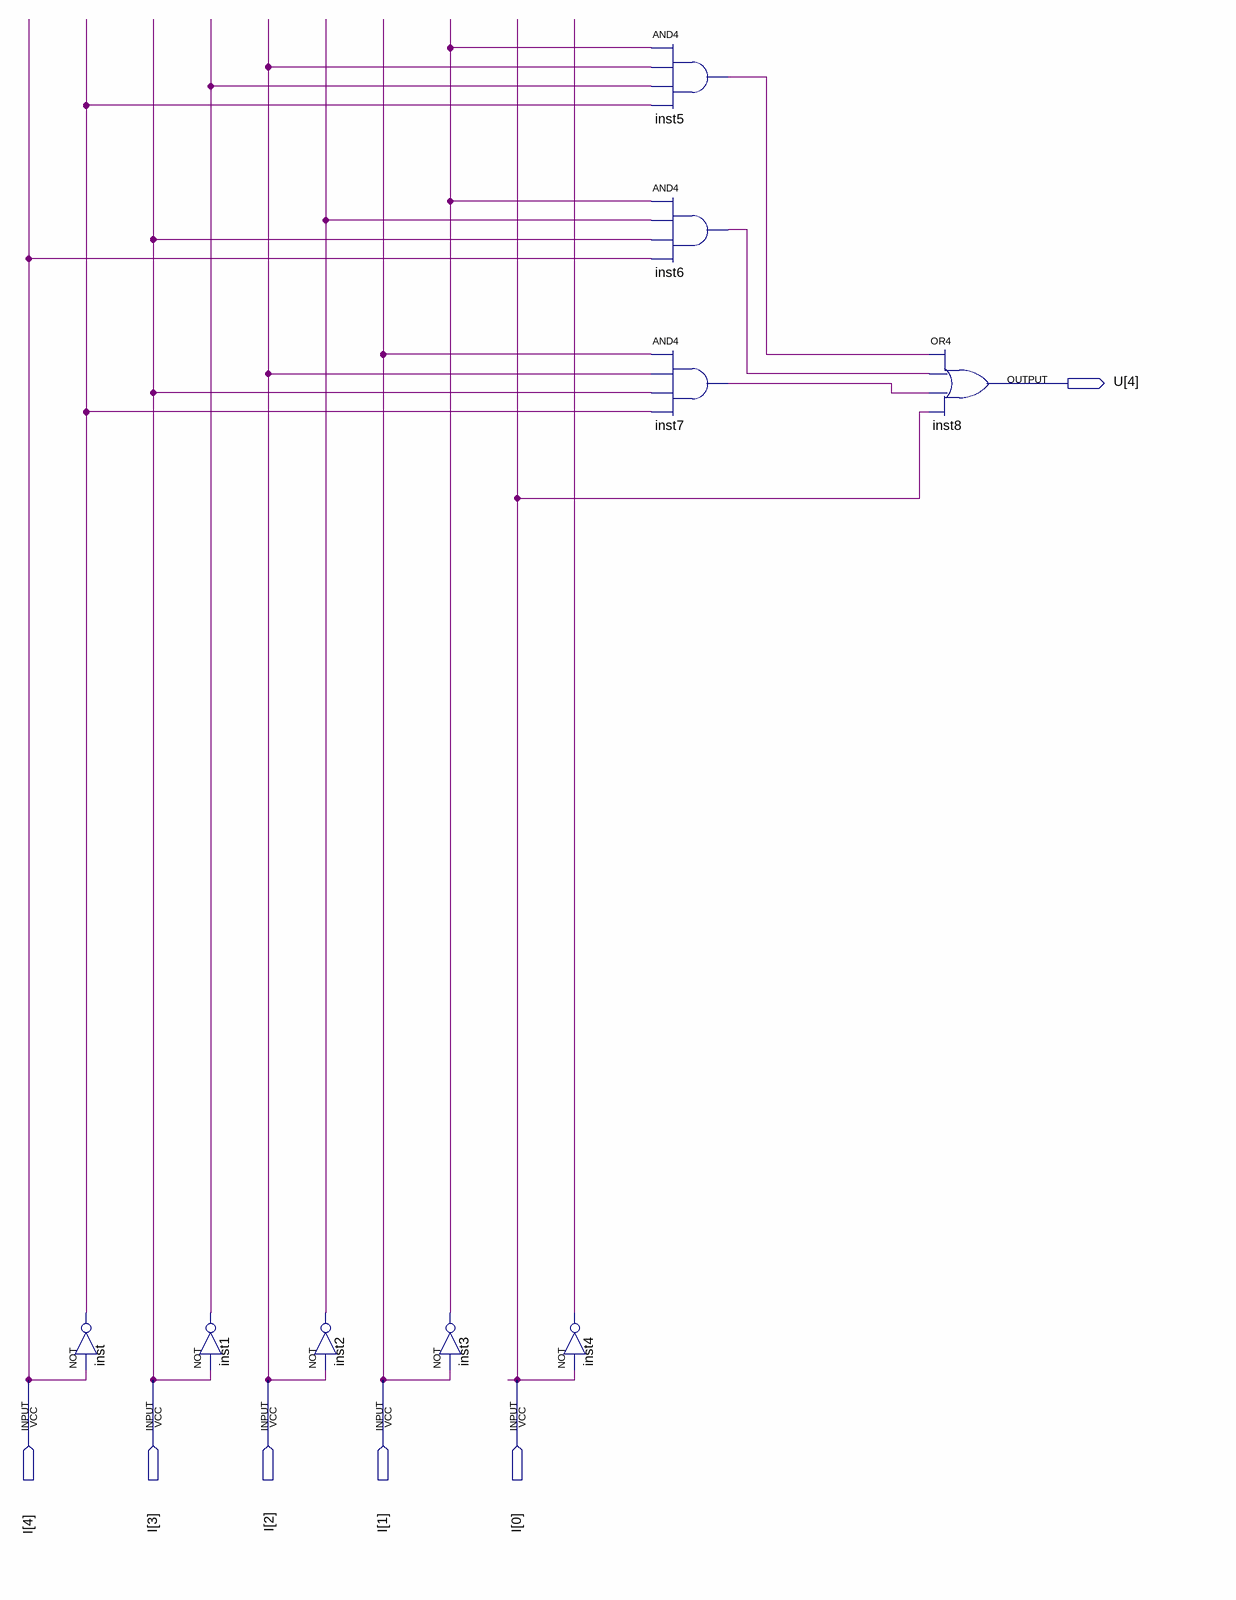
[diagram p0: schematic sheet]
// Quartus schematic BCD_e_Segment2.bdf as structural Verilog: 9 symbols, 6 pins
module BCD_e_Segment2 (
  input  [4:0] I,
  output [4:4] U
);

  wire inst1_out, inst2_out, inst3_out, inst4_out, inst5_out, inst6_out, inst7_out, inst_out;

  not inst (inst_out, I[4]);
  not inst1 (inst1_out, I[3]);
  not inst2 (inst2_out, I[2]);
  not inst3 (inst3_out, I[1]);
  not inst4 (inst4_out, I[0]);
  and inst5 (inst5_out, inst3_out, I[2], inst1_out, inst_out);
  and inst6 (inst6_out, inst3_out, inst2_out, I[3], I[4]);
  and inst7 (inst7_out, I[1], I[2], I[3], inst_out);
  or inst8 (U[4], inst5_out, inst6_out, inst7_out, I[0]);
endmodule
